# Altium schematic sheet 07_Wireless_Communication.SchDoc
size A4; DocumentNumber: 7; SheetNumber: 7; SheetTotal: 9
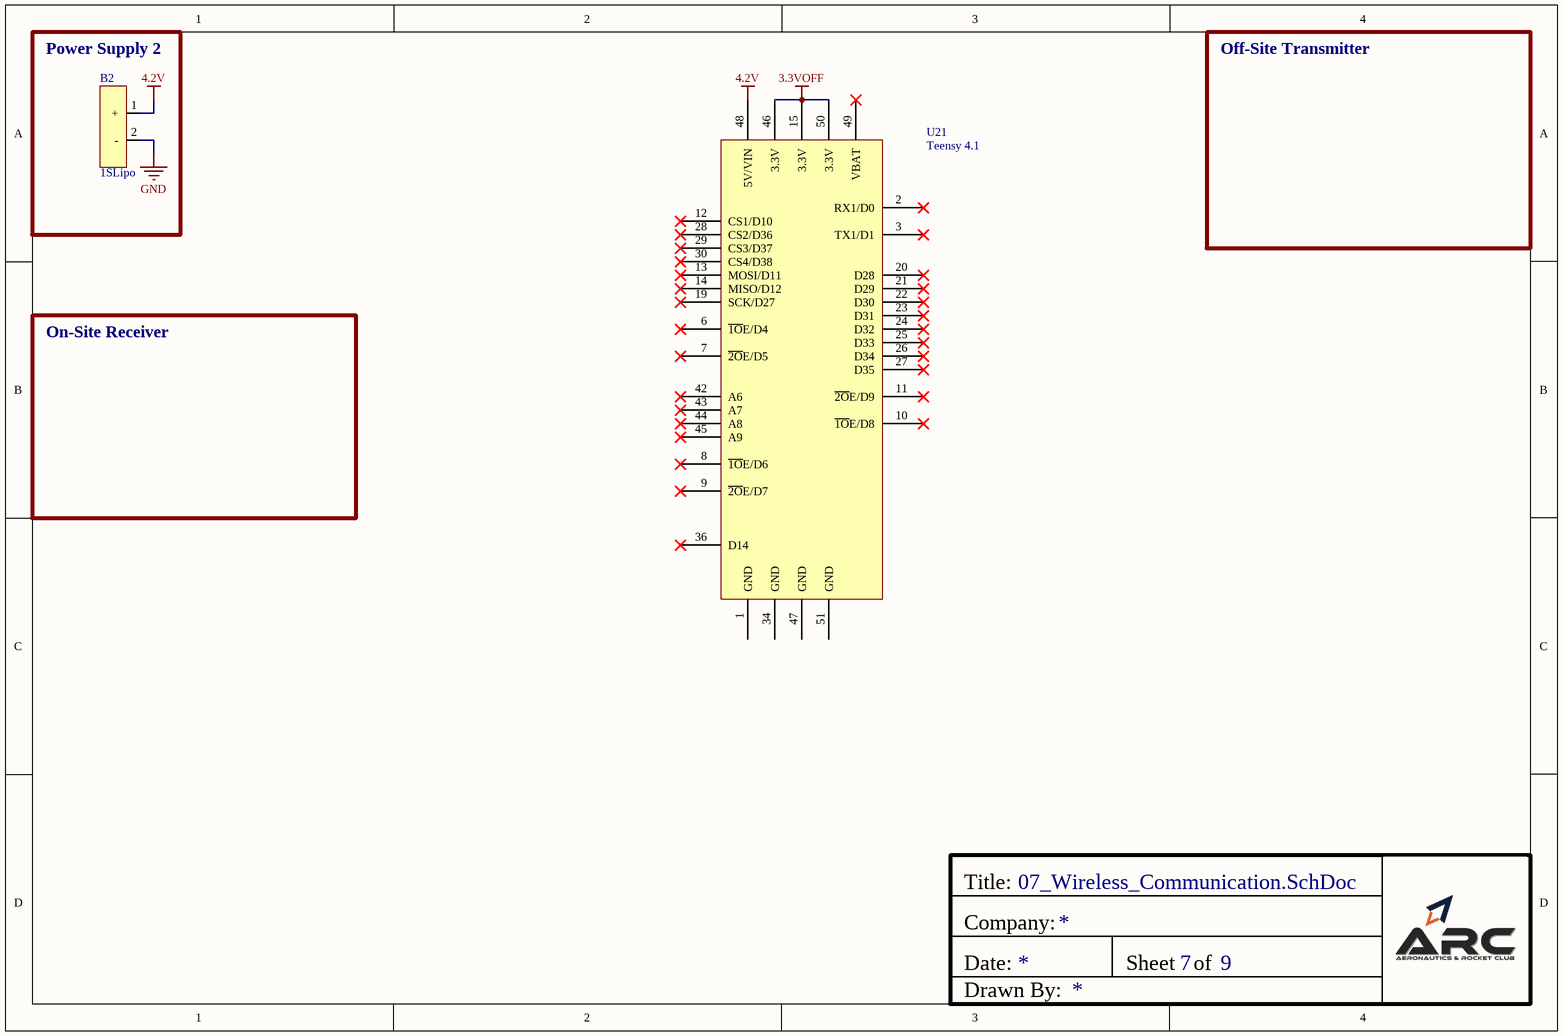
[diagram p0: 07_Wireless_Communication.SchDoc]

## Parts
B2  1SLipo  [1SLiPo]
U21  Teensy 4.1  [Teensy 4.1]

## Blocks framed on the sheet
Power Supply 2: B2

## Nets
3.3VOFF: U21.15(3.3V) U21.46(3.3V) U21.50(3.3V)
4.2V: B2.1(+) U21.48(5V/VIN)
GND: B2.2(-)

Not connected (* = marked no-connect by the designer): U21 1(GND) 2(RX1/D0)* 3(TX1/D1)* 6(~{1O}E/D4)* 7(~{2O}E/D5)* 8(~{1O}E/D6)* 9(~{2O}E/D7)* 10(~{1O}E/D8)* 11(~{2O}E/D9)* 12(CS1/D10)* 13(MOSI/D11)* 14(MISO/D12)* 19(SCK/D27)* 20(D28)* 21(D29)* 22(D30)* 23(D31)* 24(D32)* 25(D33)* 26(D34)* 27(D35)* 28(CS2/D36)* 29(CS3/D37)* 30(CS4/D38)* 34(GND) 36(D14)* 42(A6)* 43(A7)* 44(A8)* 45(A9)* 47(GND) 49(VBAT)* 51(GND)

## Notes on the sheet
- Off-Site Transmitter
- On-Site Receiver
- Title:
- Company:
- Date:
- Sheet
- of
- Drawn By:

## Library data of the parts
U21 = Teensy 4.1: RT1062 Teensy 4.1 - ARM® Cortex®-M7 MCU 32-Bit Embedded Evaluation Board 600 MHz 100 mA RTC Built-in microSD Card reader Arduino IDE compatible; Manufacturer: SparkFun; Manufacturer Part Number: DEV-16996; Supplier 1: Digi-Key; RoHS: No; Category: Embedded Processors and Controllers; Stock 1: 300; Pricing 1: 1=31.88000 (USD); Supplier Part Number 1: 1568-DEV-16996-ND